# EAGLE design VIVA_PIC16_REV5-0 (EAGLE 9.6.2)

## Sheet 1 of 3
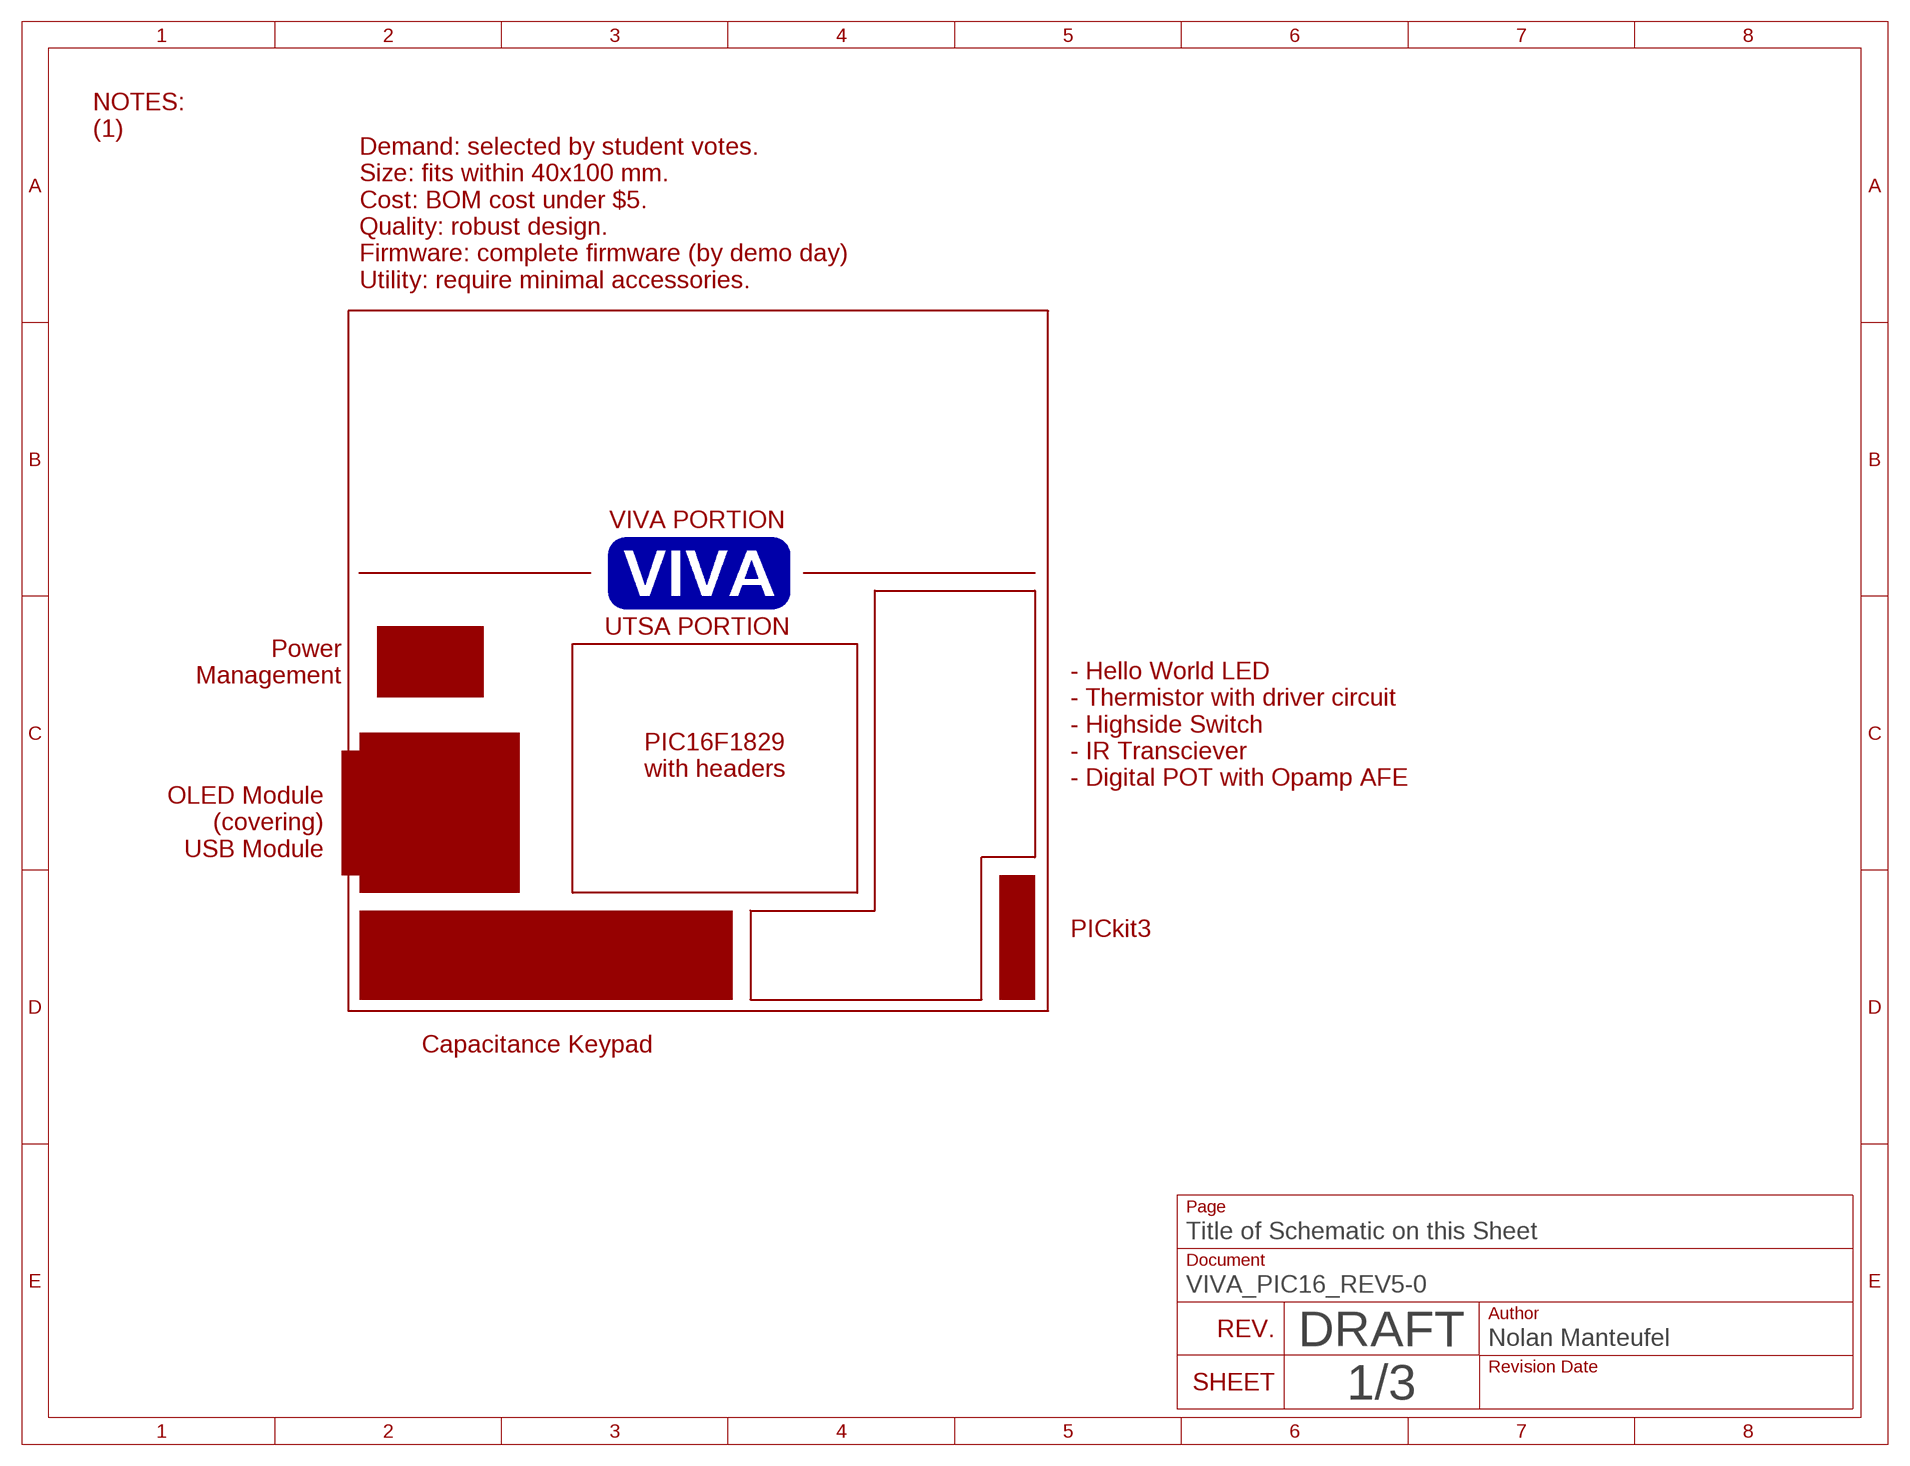
[diagram p0: schematic, sheet 1, part 1 of 2]
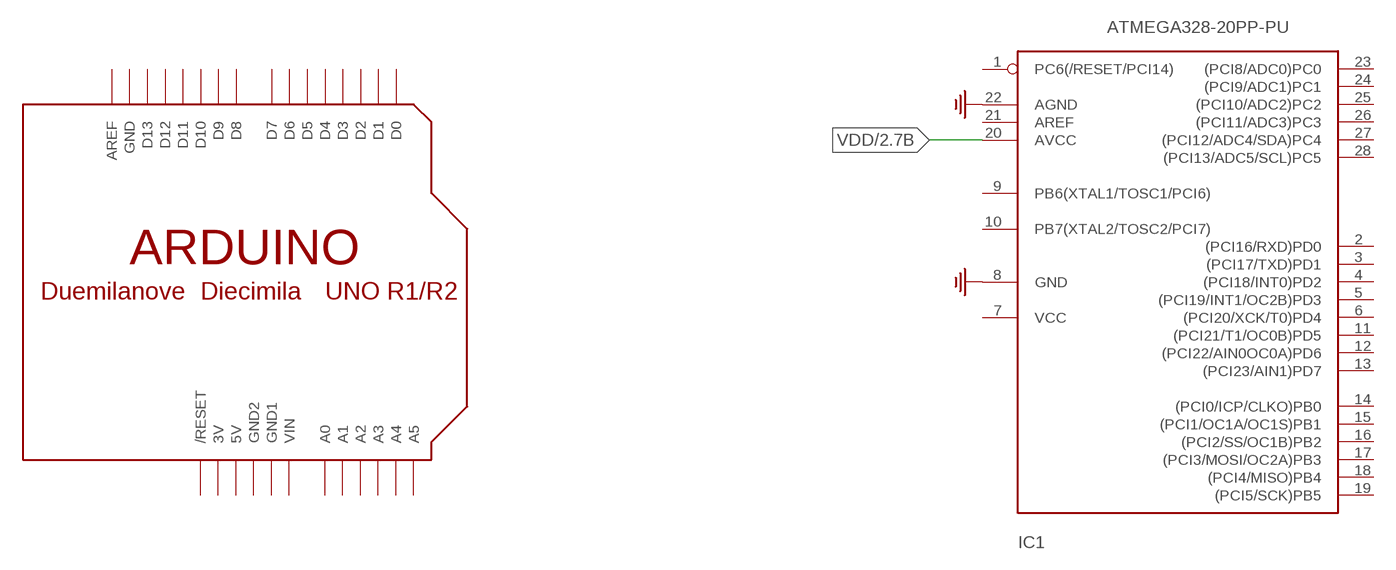
[diagram p1: schematic, sheet 1, part 2 of 2]

### Parts
IC1  ATMEGA328-20PP-PU  [DIL28-3]
U$1  VIVA_LOGO  [VIVA_LOGO]
U$3  ARDUINOUNO  [ARDUINO]

### Nets
GND: IC1.8(GND) IC1.22(AGND) ; also sheet 2,3
VDD: IC1.20(AVCC) ; also sheet 2,3
Unconnected: IC1.1(PC6(/RESET/PCI14)) IC1.2((PCI16/RXD)PD0) IC1.3((PCI17/TXD)PD1) IC1.4((PCI18/INT0)PD2) IC1.5((PCI19/INT1/OC2B)PD3) IC1.6((PCI20/XCK/T0)PD4) IC1.7(VCC) IC1.9(PB6(XTAL1/TOSC1/PCI6)) IC1.10(PB7(XTAL2/TOSC2/PCI7)) IC1.11((PCI21/T1/OC0B)PD5) IC1.12((PCI22/AIN0OC0A)PD6) IC1.13((PCI23/AIN1)PD7) IC1.14((PCI0/ICP/CLKO)PB0) IC1.15((PCI1/OC1A/OC1S)PB1) IC1.16((PCI2/SS/OC1B)PB2) IC1.17((PCI3/MOSI/OC2A)PB3) IC1.18((PCI4/MISO)PB4) IC1.19((PCI5/SCK)PB5) IC1.21(AREF) IC1.23((PCI8/ADC0)PC0) IC1.24((PCI9/ADC1)PC1) IC1.25((PCI10/ADC2)PC2) IC1.26((PCI11/ADC3)PC3) IC1.27((PCI12/ADC4/SDA)PC4) IC1.28((PCI13/ADC5/SCL)PC5) U$3.A0 U$3.A1 U$3.A2 U$3.A3 U$3.A4 U$3.A5 U$3.AREF U$3.D0 U$3.D1 U$3.D2 U$3.D3 U$3.D4 U$3.D5 U$3.D6 U$3.D7 U$3.D8 U$3.D9 U$3.D10 U$3.D11 U$3.D12 U$3.D13 U$3.RESET(/RESET)

### Notes on the sheet
- NOTES:
  (1)
- Demand: selected by student votes.
  Size: fits within 40x100 mm.
  Cost: BOM cost under $5.
  Quality: robust design.
  Firmware: complete firmware (by demo day)
  Utility: require minimal accessories.
- VIVA PORTION
- UTSA PORTION
- Power
  Management
- - Hello World LED
  - Thermistor with driver circuit
  - Highside Switch
  - IR Transciever
  - Digital POT with Opamp AFE
- PIC16F1829
  with headers
- OLED Module
  (covering)
  USB Module
- PICkit3
- Capacitance Keypad
- Page
- Title of Schematic on this Sheet
- Document
- REV. | Author
- DRAFT
- Nolan Manteufel
- SHEET | Revision Date

## Sheet 2 of 3
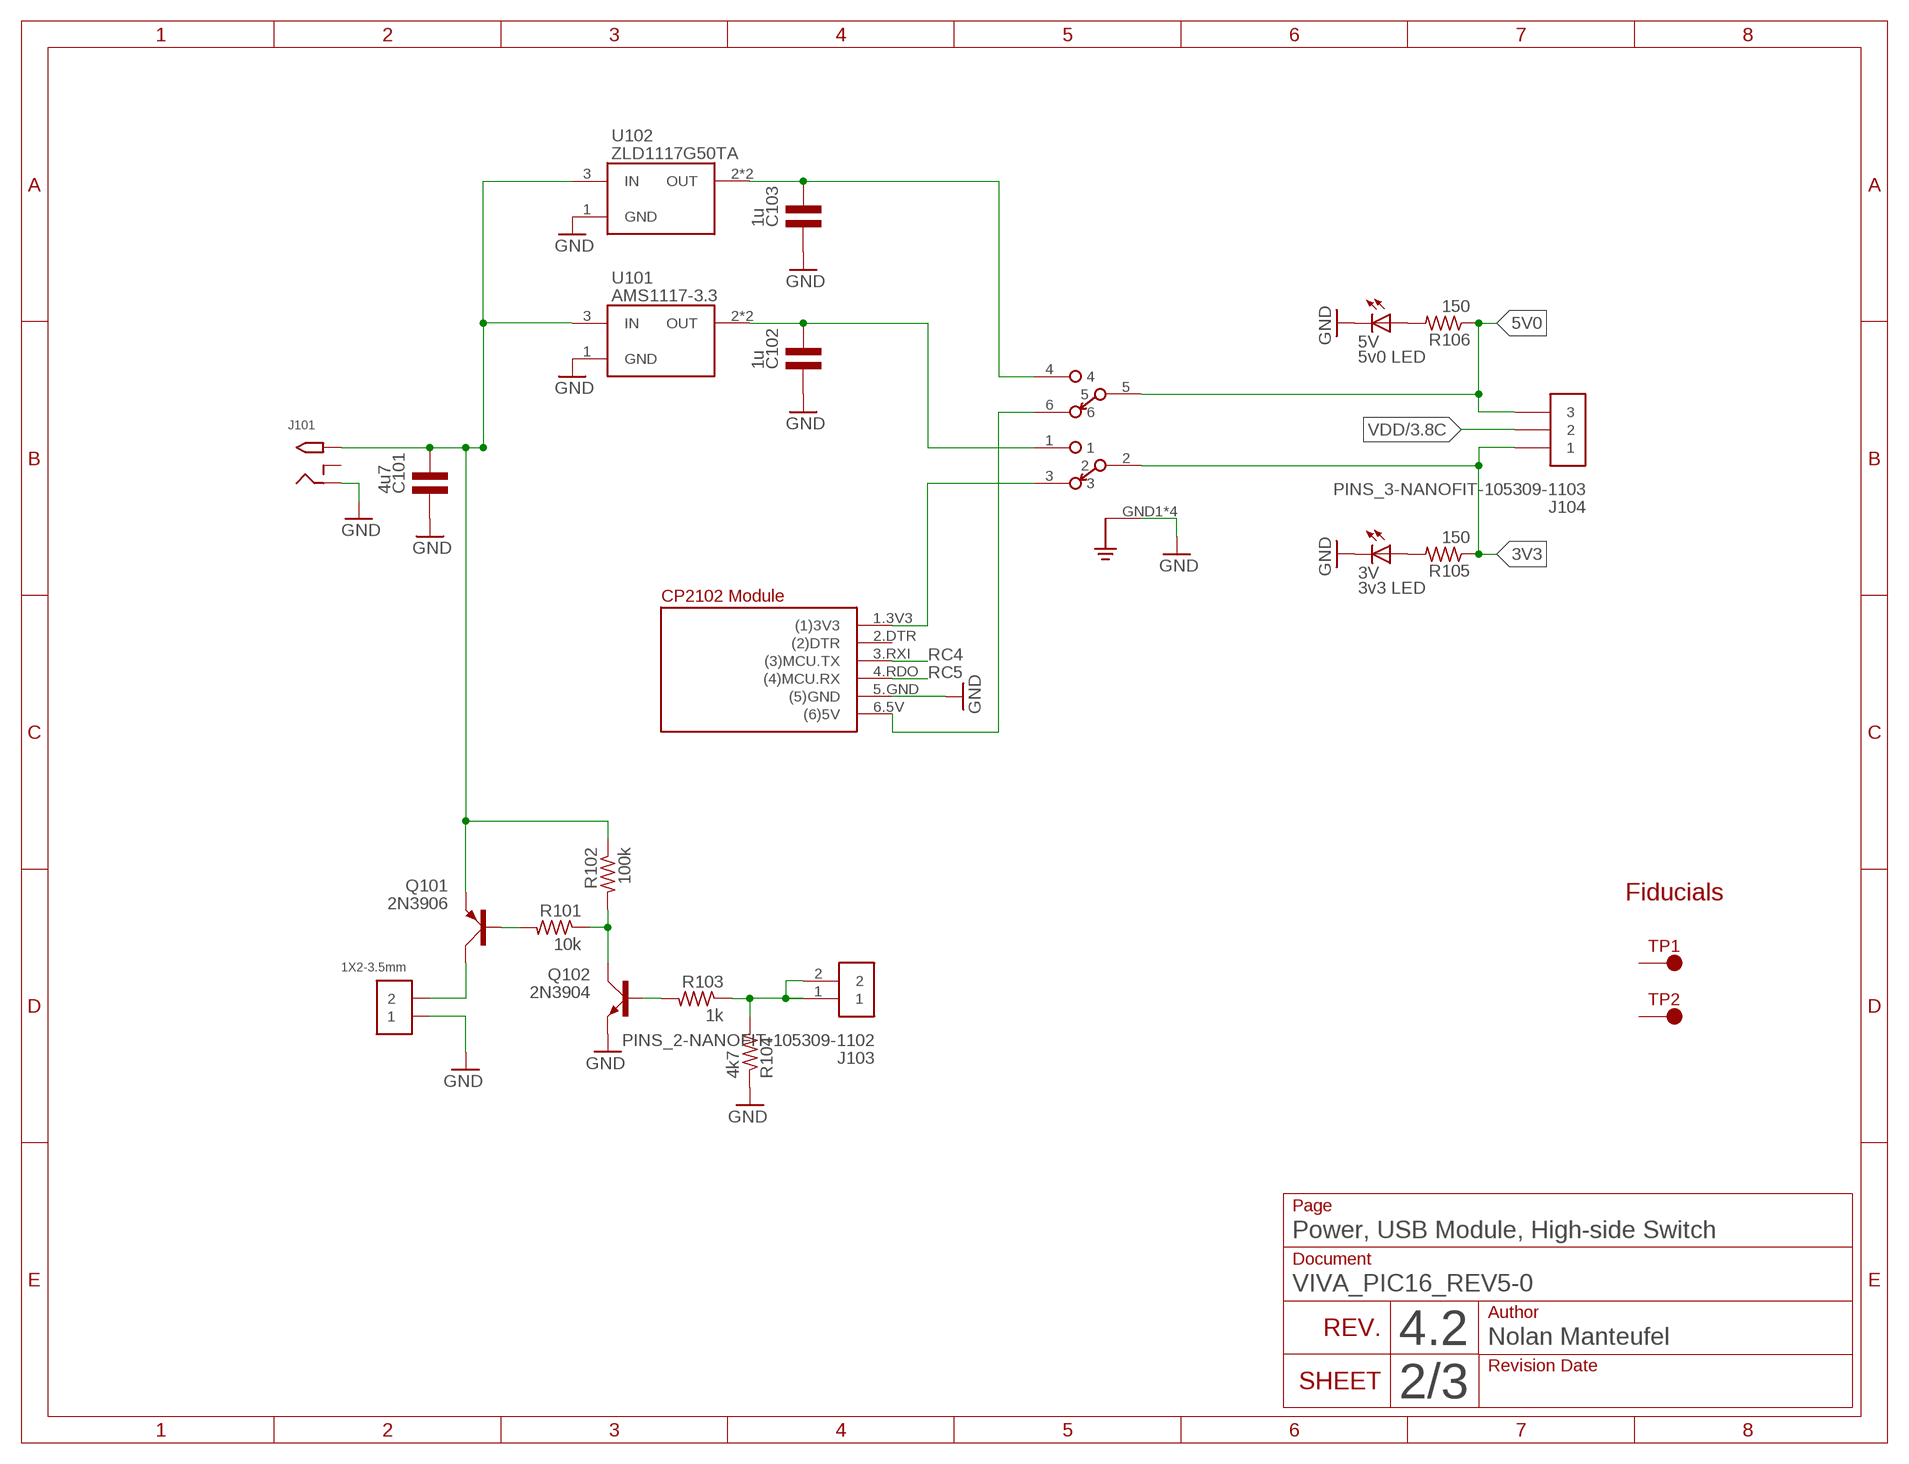
[diagram p2: schematic, sheet 2]

### Parts
3V  3v3 LED  LEDCHIPLED_0805  [CHIPLED_0805]
5V  5v0 LED  LEDCHIPLED_0805  [CHIPLED_0805]
C101  4u7  C0805  [C0805]
C102  1u  C0805  [C0805]
C103  1u  C0805  [C0805]
J101  2.1MMJACKTHM  [PJ-102A]
J102  1X2-3.5MM-3.5MM  [1X2-3.5MM]
J103  PINS_2-NANOFIT-105309-1102  [PINS_2-NANOFIT]
J104  PINS_3-NANOFIT-105309-1103  [PINS_3-NANOFIT]
M101  VIVA_USB-TTL  [VIVA_USB_TTL_SUBTEXT]
Q101  2N3906  2N3906SOT23  [SOT23]
Q102  2N3904  2N3904SOT23  [SOT23]
R101  10k  R-US_R0805  [R0805]
R102  100k  R-US_R0805  [R0805]
R103  1k  R-US_R0805  [R0805]
R104  4k7  R-US_R0805  [R0805]
R105  150  R-US_R0805  [R0805]
R106  150  R-US_R0805  [R0805]
S101  SWITCH_OS202013  [OS202013MT5QN1]
TP1  TESTPOINTFIDUCIAL  [FIDUCIAL]
TP2  TESTPOINTFIDUCIAL  [FIDUCIAL]
U101  AMS1117-3.3  REGULATOR_SCHLM1117  [SOT223]
U102  ZLD1117G50TA  REGULATOR_SCHLM1117  [SOT223]

### Nets
3V3: J104.1 R105.1 S101.2
5V0: J104.3 R106.1 S101.5
GND: 3V.C 5V.C C101.1 C102.1 C103.1 J101.RING J102.1 M101.5.GND((5)GND) Q102.2(E) R104.1 S101.GND1(GND) S101.GND2(GND) S101.GND3(GND) S101.GND4(GND) U101.1(GND) U102.1(GND) ; also sheet 1,3
N$1: J103.1 J103.2 R103.1 R104.2
N$2: 5V.A R106.2
N$5: Q101.1(B) R101.2
N$8: Q102.3(C) R101.1 R102.2
N$10: Q102.1(B) R103.2
N$14: M101.1.3V3((1)3V3) S101.3
N$15: J102.2 Q101.3(C)
N$16: M101.6.5V((6)5V) S101.6
N$17: C103.2 S101.4 U102.2(OUT) U102.4.TAB(OUT)
N$18: C102.2 S101.1 U101.2(OUT) U101.4.TAB(OUT)
N$21: 3V.A R105.2
RC4: M101.3.RXI((3)MCU.TX) ; also sheet 3
RC5: M101.4.RDO((4)MCU.RX) ; also sheet 3
VDC: C101.2 J101.TIP Q101.2(E) R102.1 U101.3(IN) U102.3(IN)
VDD: J104.2 ; also sheet 1,3
Unconnected: J101.RING_SW M101.2.DTR((2)DTR) TP1.FIDUCIAL TP2.FIDUCIAL

### Notes on the sheet
- Fiducials
- Page
- Power, USB Module, High-side Switch
- Document
- REV. | Author
- 4.2 | Nolan Manteufel
- SHEET | Revision Date

## Sheet 3 of 3
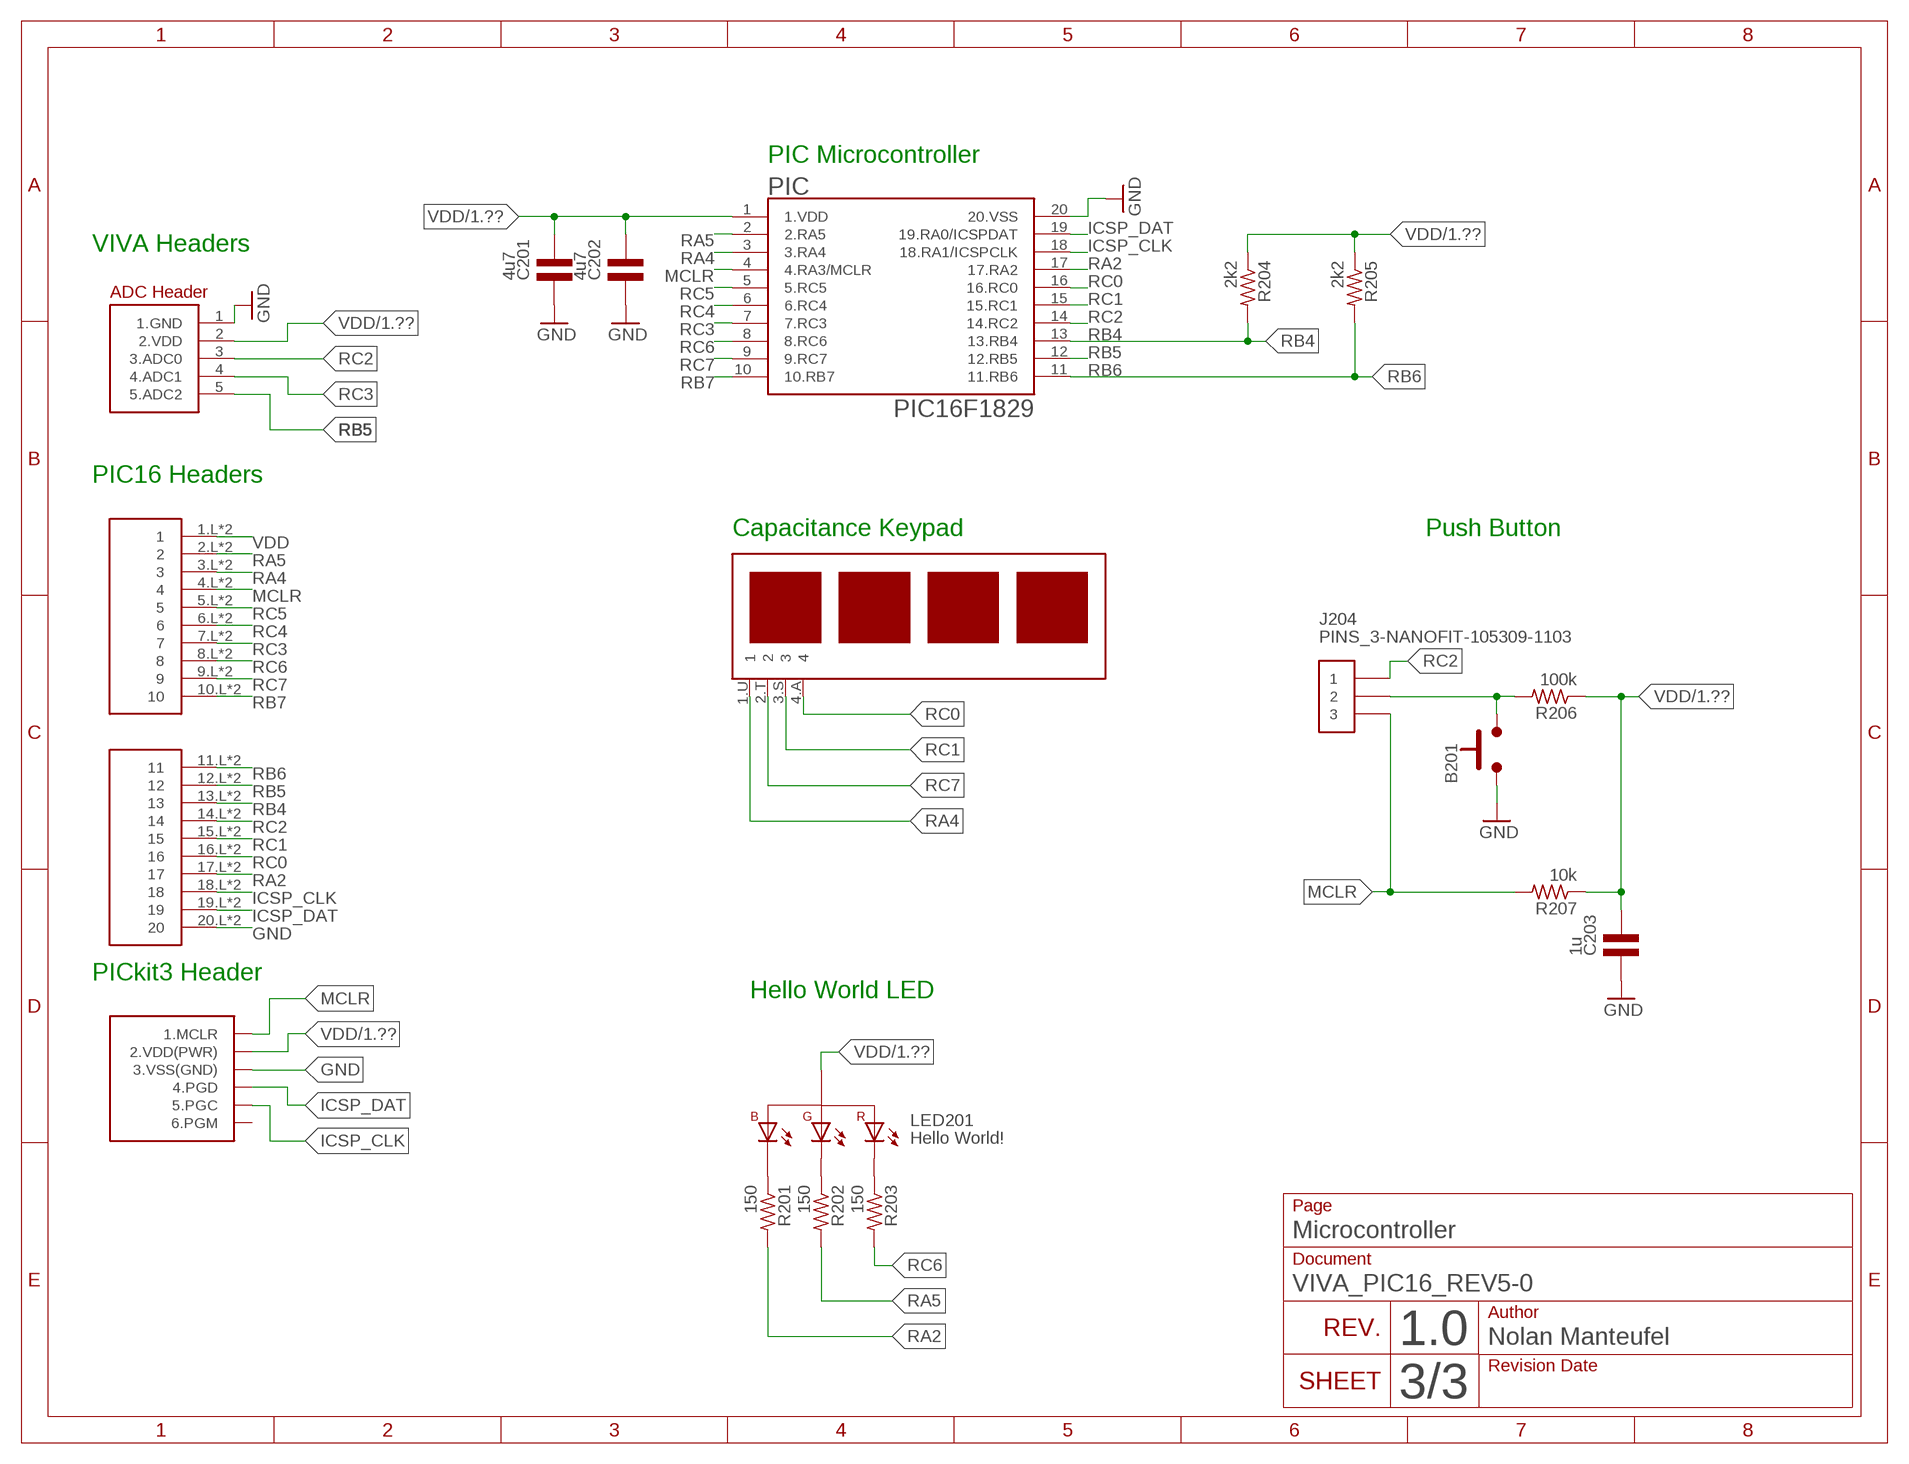
[diagram p3: schematic, sheet 3]

### Parts
B201  PUSHBUTTON6X6MM  [6X6MM]
C201  4u7  C0805  [C0805]
C202  4u7  C0805  [C0805]
C203  1u  C0805  [C0805]
J201  VIVA_PIC16  [VIVA_PIC16]
J202  VIVA-HEADER-ADCNONAME  [VIVA-HEADER-ADC-NONAME]
J203  PICKIT3  [PICKIT3]
J204  PINS_3-NANOFIT-105309-1103  [PINS_3-NANOFIT]
LED201  Hello World!  RGB_LEDLTST-C19FD1WT  [0805_RGB]
PIC  PIC16F1829  [SOP20-NEW]
R201  150  R-US_R0805  [R0805]
R202  150  R-US_R0805  [R0805]
R203  150  R-US_R0805  [R0805]
R204  2k2  R-US_R0805  [R0805]
R205  2k2  R-US_R0805  [R0805]
R206  100k  R-US_R0805  [R0805]
R207  10k  R-US_R0805  [R0805]
U$201  VIVA_UTSA-KEYPAD  [VIVA_UTSA-KEYPAD]

### Nets
GND: B201.1.A B201.2.A C201.1 C202.1 C203.1 J201.20.L J201.20.R J202.1(1.GND) J203.3(3.VSS(GND)) PIC.20(20.VSS) ; also sheet 1,2
ICSP_CLK: J201.18.L J201.18.R J203.5(5.PGC) PIC.18(18.RA1/ICSPCLK)
ICSP_DAT: J201.19.L J201.19.R J203.4(4.PGD) PIC.19(19.RA0/ICSPDAT)
MCLR: J201.4.L J201.4.R J203.1(1.MCLR) J204.3 PIC.4(4.RA3/MCLR) R207.2
N$7: B201.3.B B201.4.B J204.2 R206.2
N$11: LED201.1(4.B-) R201.1
N$12: LED201.3(2.G-) R202.1
N$13: LED201.2(1.R-) R203.1
RA2: J201.17.L J201.17.R PIC.17(17.RA2) R201.2
RA4: J201.3.L J201.3.R PIC.3(3.RA4) U$201.1.U
RA5: J201.2.L J201.2.R PIC.2(2.RA5) R202.2
RB4: J201.13.L J201.13.R PIC.13(13.RB4) R204.2
RB5: J201.12.L J201.12.R J202.5(5.ADC2) PIC.12(12.RB5)
RB6: J201.11.L J201.11.R PIC.11(11.RB6) R205.2
RB7: J201.10.L J201.10.R PIC.10(10.RB7)
RC0: J201.16.L J201.16.R PIC.16(16.RC0) U$201.4.A
RC1: J201.15.L J201.15.R PIC.15(15.RC1) U$201.3.S
RC2: J201.14.L J201.14.R J202.3(3.ADC0) J204.1 PIC.14(14.RC2)
RC3: J201.7.L J201.7.R J202.4(4.ADC1) PIC.7(7.RC3)
RC4: J201.6.L J201.6.R PIC.6(6.RC4) ; also sheet 2
RC5: J201.5.L J201.5.R PIC.5(5.RC5) ; also sheet 2
RC6: J201.8.L J201.8.R PIC.8(8.RC6) R203.2
RC7: J201.9.L J201.9.R PIC.9(9.RC7) U$201.2.T
VDD: C201.2 C202.2 C203.2 J201.1.L J201.1.R J202.2(2.VDD) J203.2(2.VDD(PWR)) LED201.4(3.+) PIC.1(1.VDD) R204.1 R205.1 R206.1 R207.1 ; also sheet 1,2
Unconnected: J203.6(6.PGM)

### Notes on the sheet
- PIC Microcontroller
- VIVA Headers
- PIC16 Headers
- Capacitance Keypad | Push Button
- PICkit3 Header
- Hello World LED
- Page
- Microcontroller
- Document
- REV. | Author
- 1.0 | Nolan Manteufel
- SHEET | Revision Date

## Power pins joined to a net without a drawn wire
3V: U$3.3V
5V: U$3.5V
GND: U$3.GND
GND1: U$3.GND1
GND2: U$3.GND2
VIN: U$3.VIN

## Library data of the parts
3V 5V = adafruit:LED: LED OSRAM: - CHIPLED LG R971, LG N971, LY N971, LG Q971, LY Q971, LO R971, LY R971 LH N974, LH R974 LS Q976, LO Q976, LY Q976 LO Q996 - Hyper CHIPLED LW Q18S LB Q993, LB Q99A, LB R99A - SideLED LS A670, LO A670, LY A670, LG A670, LP A670 LB A673, LV A673, LT A673, LW A673 LH A674 LY A675 LS A676, LA A676, LO A676, LY A676, LW A676 LS A679, LY A679, LG A679 - Hyper Micro SIDELED® LS Y876, LA Y876, LO Y876, LY Y876 LT Y87S - SmartLED LW L88C, LW L88S LB L89C, LB L89S, LG L890 LS L89K, LO L89K, LY L89K LS L896, LA L896, LO L896, LY L896 - TOPLED LS T670, LO T670, LY T670, LG T670, LP T670 LSG T670, LSP T670, LSY T670, LOP T670, LYG T670 LG T671, LOG T671, LSG T671 LB T673, LV T673, LT T673, LW T673 LH T674 LS T676, LA T676, LO T676, LY T676, LB T676, LH T676, LSB T676, LW T676 LB T67C, LV T67C, LT T67C, LS T67K, LO T67K, LY T67K, LW E67C LS E67B, LA E67B, LO E67B, LY E67B, LB E67C, LV E67C, LT E67C LW T67C LS T679, LY T679, LG T679 LS T770, LO T770, LY T770, LG T770, LP T770 LB T773, LV T773, LT T773, LW T773 LH T774 LS E675, LA E675, LY E675, LS T675 LS T776, LA T776, LO T776, LY T776, LB T776 LHGB T686 LT T68C, LB T68C - Hyper Mini TOPLED® LB M676 - Mini TOPLED Santana® LG M470 LS M47K, LO M47K, LY M47K Source: http://www.osram.convergy.de/
B201 = nolan-utsa:PUSHBUTTON: Tactile push button switch
C101-C103 C201-C203 = nolan-utsa:C
IC1 = nolan-utsa:ATMEGA328*P: MICROCONTROLLER 32 kBytes FLASH 2 kBytes SRAM 1 kBytes EEPROM USART 8-channel 10 bit ADC
J101 = nolan-utsa:2.1MMJACK: 2.1mm x 5.5mm THM DC jack with internal switch. Digikey part #PJ-102A, 4UCON part #05537 2.1mm x 5.5mm SMT DC jack with internal switch. Digikey part #PJ-002A-SMT, 4UCON part #03267 By microbuilder.eu & adafruit.com
J102 = nolan-utsa:1X2-3.5MM: 3.5mm Terminal block http://www.ladyada.net/library/pcb/eaglelibrary.html
J103 = nolan-utsa:PINS_2
J104 J204 = nolan-utsa:PINS_3
J201 = nolan-viva:VIVA_PIC16
J202 = nolan-utsa:VIVA-HEADER-ADC
J203 = nolan-viva:PICKIT3
LED201 = nolan-utsa:RGB_LED
M101 = nolan-utsa:VIVA_USB-TTL
PIC = nolan-utsa:PIC16F1829
Q101 = nolan-utsa:2N3906: PNP TRANSISTOR
Q102 = nolan-utsa:2N3904: NPN TRANSISTOR
R101-R106 R201-R207 = adafruit:R-US_: RESISTOR, American symbol
S101 = nolan-utsa:SWITCH_OS202013
TP1 TP2 = nolan-utsa:TESTPOINT
U101 U102 = nolan-utsa:REGULATOR_SCH: Linear Regulator in SOT-223 package. NOTE: select correct pinout for your application. Tab may be OUT or GND!
U$1 = nolan-utsa:VIVA_LOGO
U$3 = nolan-utsa:ARDUINO: Arduino Diecimila/Duemilanove Make a shield with ease, this package has all the named pins as well as the two mounting drill holes and an outline of the USB and DC power connector. The outline is on the DIMENSION layer, so if your board house uses it they will cut the outline to match. http://www.ladyada.net/library/pcb/eaglelibrary.html
U$201 = nolan-utsa:VIVA_UTSA-KEYPAD

## Board
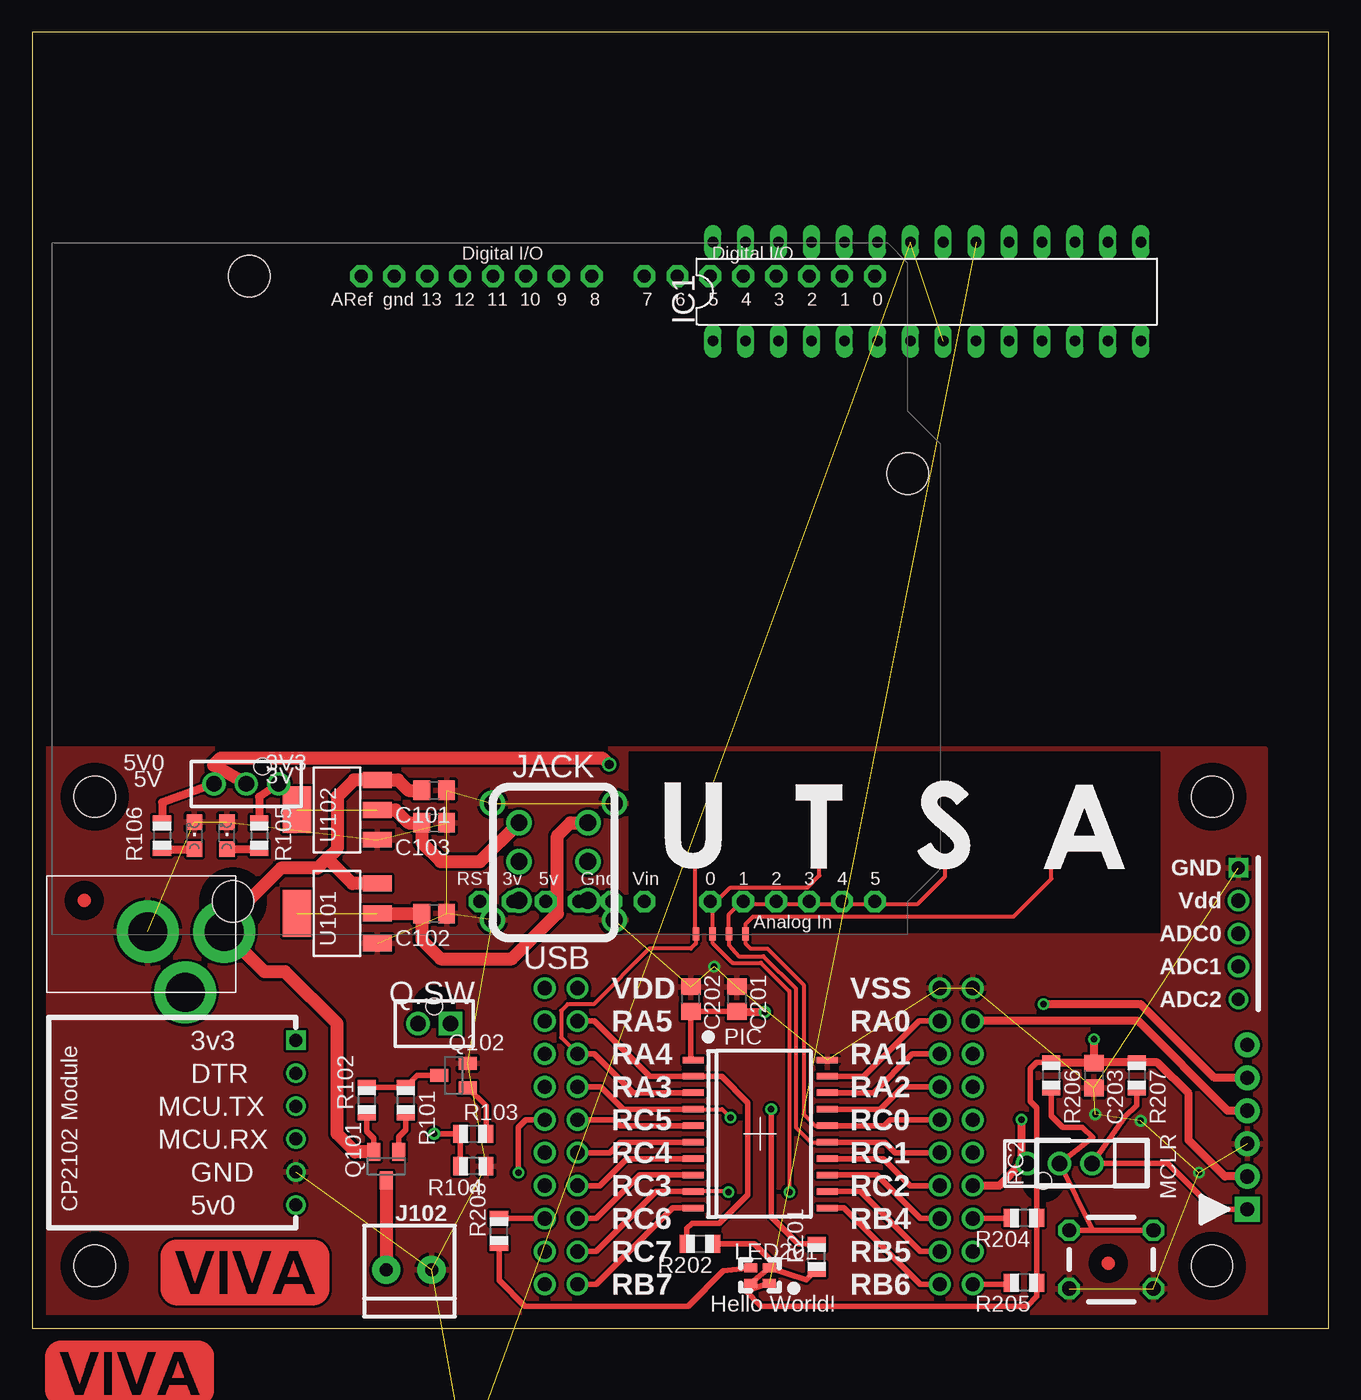
[diagram p4: board, top side]
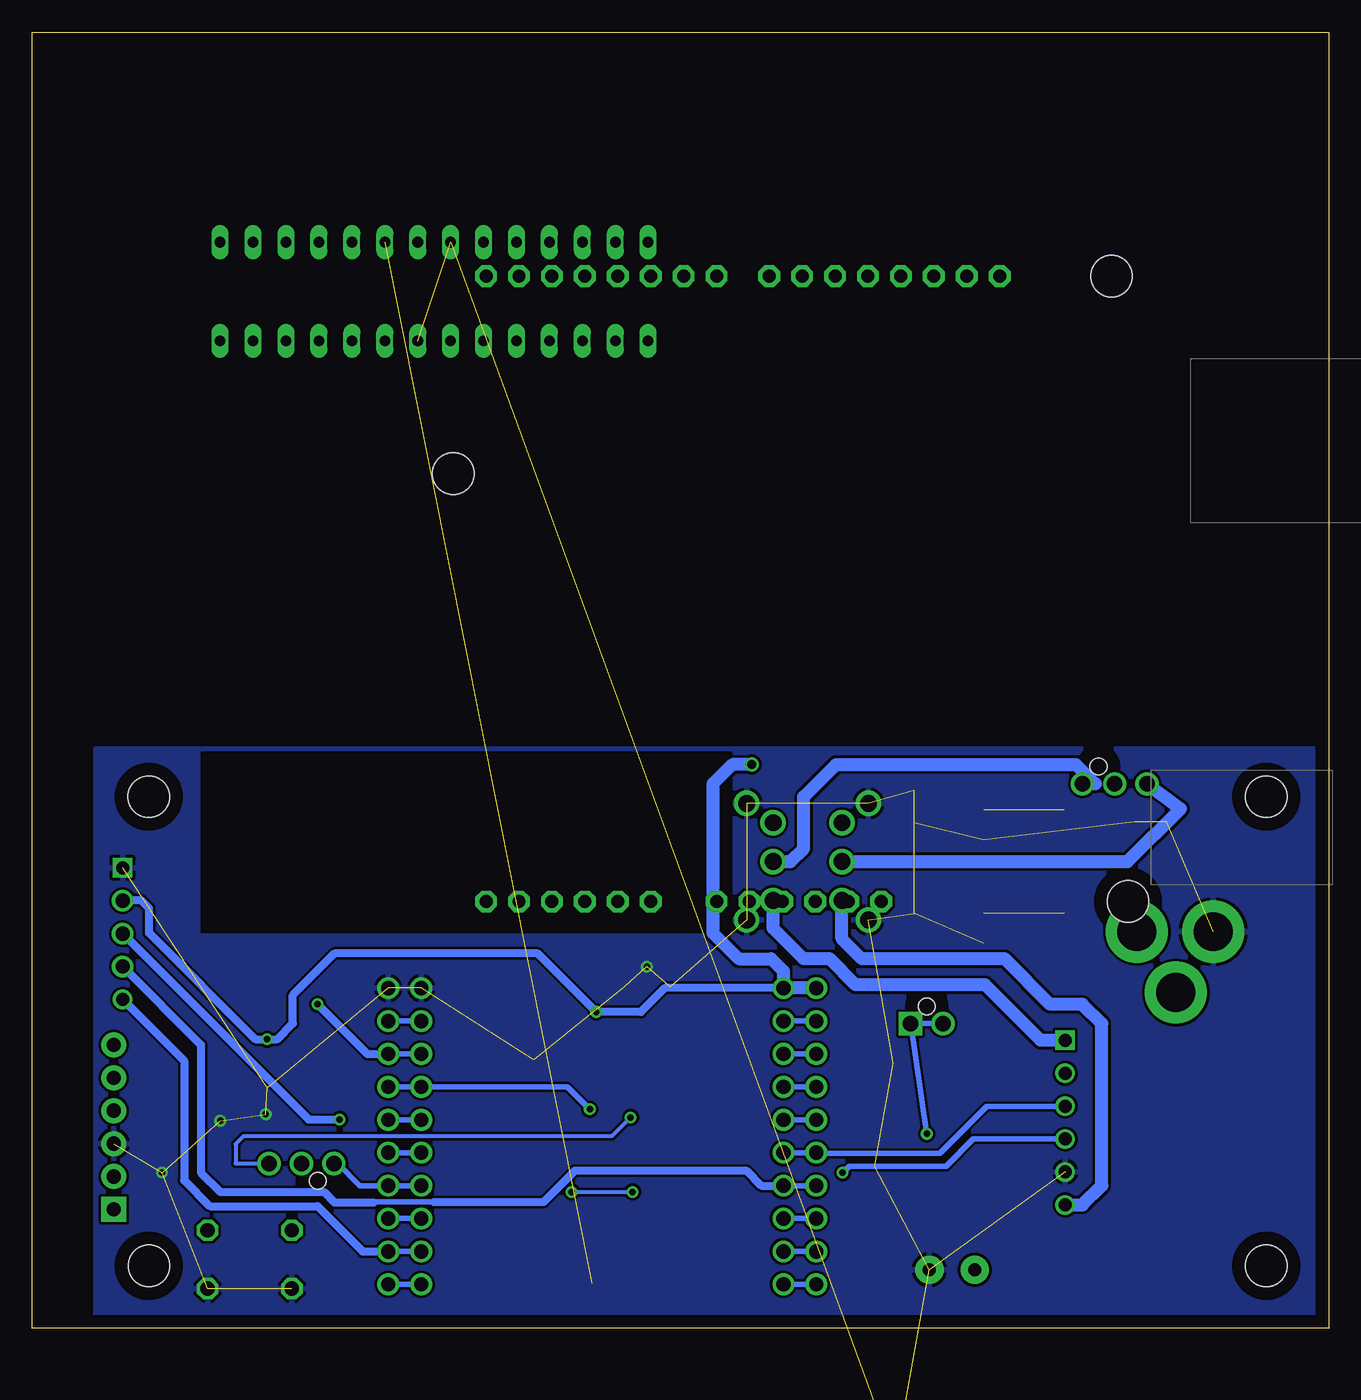
[diagram p5: board, bottom side, seen from below]

Size 100 x 100 mm. Coordinates in mm from the lower left corner, seen from the top.
Outline: 0,0 100,0 100,100 0,100 0,0
Copper layers (1*16): Top 0.035mm / dielectric 1.5mm / Bottom 0.035mm
Design rules "default *": minimum track width 10mil, minimum drill 24mil, track to track 8mil, track to pad 8mil, pad to pad 8mil, via to via 8mil, smd to smd 8mil, copper to edge 40mil, drill to drill 8mil, minimum pad ring 10mil, minimum via ring 8mil, stop-mask expansion 4mil, vias tented up to drill 20mil, thermal gap 10mil
Holes 3.2 mm at 4.82,41.01 4.82,4.81 91.01,4.81 91.02,41.01

### Footprints (pad centres in the part's own frame; a part is rotated, then mirrored left to right if it is on the bottom)
CHIPLED_0805 = smd 1.2 x 1.2: A 0,-1.05; C 0,1.05
6X6MM = drill 1.1 octagon: 1.A 0,0; 2.A 6.5,0; 3.B 0,4.5; 4.B 6.5,4.5
C0805 = smd 1.3 x 1.5: 1 -0.95,0; 2 0.95,0
DIL28-3 = drill 0.813 long: 1 -16.51,-3.81; 2 -13.97,-3.81; 3 -11.43,-3.81; 4 -8.89,-3.81; 5 -6.35,-3.81; 6 -3.81,-3.81; 7 -1.27,-3.81; 8 1.27,-3.81; 9 3.81,-3.81; 10 6.35,-3.81; 11 8.89,-3.81; 12 11.43,-3.81; 13 13.97,-3.81; 14 16.51,-3.81; 15 16.51,3.81; 16 13.97,3.81; 17 11.43,3.81; 18 8.89,3.81; 19 6.35,3.81; 20 3.81,3.81; 21 1.27,3.81; 22 -1.27,3.81; 23 -3.81,3.81; 24 -6.35,3.81; 25 -8.89,3.81; 26 -11.43,3.81; 27 -13.97,3.81; 28 -16.51,3.81
PJ-102A = drill 3 pad 4.8: RING 0.1,-3.39; RING_SW -4.6,-6.29; TIP 0.1,-9.29
1X2-3.5MM = drill 1 pad 2.184: 1 1.8,0; 2 -1.7,0
PINS_2-NANOFIT = drill 1.2 square: 1 -1.25,0 | drill 1.2: 2 1.25,0 | hole 1.3: 0,-1.34
PINS_3-NANOFIT = drill 1.2: 1 -2.5,0; 2 0,0; 3 2.5,0 | hole 1.3: -1.25,-1.34
VIVA_PIC16 = drill 1.1 pad 1.676: 1.L -2.54,0; 1.R 0,0; 2.L -2.54,-2.54; 2.R 0,-2.54; 3.L -2.54,-5.08; 3.R 0,-5.08; 4.L -2.54,-7.62; 4.R 0,-7.62; 5.L -2.54,-10.16; 5.R 0,-10.16; 6.L -2.54,-12.7; 6.R 0,-12.7; 7.L -2.54,-15.24; 7.R 0,-15.24; 8.L -2.54,-17.78; 8.R 0,-17.78; 9.L -2.54,-20.32; 9.R 0,-20.32; 10.L -2.54,-22.86; 10.R 0,-22.86; 11.L 27.94,-22.86; 11.R 30.48,-22.86; 12.L 27.94,-20.32; 12.R 30.48,-20.32; 13.L 27.94,-17.78; 13.R 30.48,-17.78; 14.L 27.94,-15.24; 14.R 30.48,-15.24; 15.L 27.94,-12.7; 15.R 30.48,-12.7; 16.L 27.94,-10.16; 16.R 30.48,-10.16; 17.L 27.94,-7.62; 17.R 30.48,-7.62; 18.L 27.94,-5.08; 18.R 30.48,-5.08; 19.L 27.94,-2.54; 19.R 30.48,-2.54; 20.L 27.94,0; 20.R 30.48,0
VIVA-HEADER-ADC-NONAME = drill 1 square: 1 0,0 | drill 1.1: 2 2.54,0; 3 5.08,0; 4 7.62,0 | drill 1: 5 10.16,0
PICKIT3 = drill 1.1 pad 1.93 square: 1 0,0 | drill 1.1 pad 1.93: 2 2.54,0; 3 5.08,0; 4 7.62,0; 5 10.16,0; 6 12.7,0
0805_RGB = smd 1 x 0.7: 1 0.7,0.6; 2 -0.7,0.6; 3 -0.7,-0.6; 4 0.7,-0.6
VIVA_USB_TTL_SUBTEXT = drill 1 square: 1.3V3 0,0 | drill 1: 2.DTR 0,-2.54; 3.RXI 0,-5.08; 4.RDO 0,-7.62; 5.GND 0,-10.16; 6.5V 0,-12.7
SOP20-NEW = smd 0.5 x 1.6: 1 -5.715,-5.152; 2 -4.445,-5.152; 3 -3.175,-5.152; 4 -1.905,-5.152; 5 -0.635,-5.152; 6 0.635,-5.152; 7 1.905,-5.152; 8 3.175,-5.152; 9 4.445,-5.152; 10 5.715,-5.152; 11 5.715,5.188; 12 4.445,5.188; 13 3.175,5.188; 14 1.905,5.188; 15 0.635,5.188; 16 -0.635,5.188; 17 -1.905,5.188; 18 -3.175,5.188; 19 -4.445,5.188; 20 -5.715,5.188
SOT23 = smd 1 x 1.4: 1 -0.95,-1.1; 2 0.95,-1.1; 3 0,1.1
R0805 = smd 1.1 x 1.4: 1 -1,0; 2 1,0
OS202013MT5QN1 = drill 1.3: 1 1.499,7.353; 2 4.496,7.353; 3 7.493,7.353; 4 1.499,2.045; 5 4.496,2.045; 6 7.493,2.045; GND1 0,9.398; GND2 8.992,9.398; GND3 0,0; GND4 8.992,0
FIDUCIAL = smd 0 x 0: FIDUCIAL 0,0
SOT223 = smd 1.219 x 2.235: 1 -2.311,-3.099; 2 0,-3.099; 3 2.311,-3.099 | smd 3.6 x 2.2: 4.TAB 0,3.099
ARDUINO = drill 1 pad 1.676 octagon: 3V 35.56,2.54; 5V 38.1,2.54; A0 50.8,2.54; A1 53.34,2.54; A2 55.88,2.54; A3 58.42,2.54; A4 60.96,2.54; A5 63.5,2.54; AREF 23.876,50.8; D0 63.5,50.8; D1 60.96,50.8; D2 58.42,50.8; D3 55.88,50.8; D4 53.34,50.8; D5 50.8,50.8; D6 48.26,50.8; D7 45.72,50.8; D8 41.656,50.8; D9 39.116,50.8; D10 36.576,50.8; D11 34.036,50.8; D12 31.496,50.8; D13 28.956,50.8; GND 26.416,50.8; GND1 43.18,2.54; GND2 40.64,2.54; RESET 33.02,2.54; VIN 45.72,2.54 | hole 3.2: 15.24,50.8; 66.04,35.56; 13.97,2.54
VIVA_UTSA-KEYPAD = smd 0.5 x 1: 1.U -3.81,-5.08; 2.T -2.54,-5.08; 3.S -1.27,-5.08; 4.A 0,-5.08

### Placement (x,y rotation side)
3V  15,38 0 top
5V  12.5,38 0 top
B201  79.99,3.05 0 top
C101  31,41.5 180 top
C102  31,32 180 top
C103  31,39 180 top
C201  54.36,25.4 270 top
C202  50.8,25.4 270 top
C203  81.9,19.5 90 top
IC1  69,80 0 top
J101  5.5,30.5 90 top
J102  29,4.5 0 top
J103  31,23.5 180 top
J104  16.5,42 180 top
J201  42.06,26.24 0 top
J202  93.04,35.53 270 top
J203  93.73,9.16 90 top
J204  79.25,12.7 0 top
LED201  56.13,4.06 0 top
M101  20.32,22.21 0 top
PIC  56.13,14.99 270 top
Q101  27.3,12.5 180 top
Q102  32.5,19.5 90 top
R101  28.8,17.6 270 top
R102  25.8,17.6 90 top
R103  34,15 0 top
R104  34,12.5 180 top
R105  17.5,38 270 top
R106  10,38 270 top
R201  60.5,5.5 90 top
R202  51.5,6.5 180 top
R203  36,7.5 90 top
R204  76.5,8.5 180 top
R205  76.5,3.5 180 top
R206  78.6,19.5 270 top
R207  85.2,19.5 270 top
S101  35.5,40.5 270 top
TP1  83,5 0 top
TP2  4,33 0 top
U101  23.5,32 90 top
U102  23.5,40 90 top
U$1  1,-6 0 top  (outside the outline)
U$2  [VIVA_LOGO]  9.91,1.79 0 top
U$3  1.5,30.38 0 top
U$201  55,35.5 0 top

### Tracks (layer width: path | path; a pad name or v marks a point on that pad's centre or on a via)
3V3
  Top 0.61: J104.1 17.5,41 R105.1
  Bottom 1.016: S101.2 41.5,36 40.5,37 40.5,41 38,43.5 19.5,43.5 18,42 J104.1
5V0
  Top 0.61: J104.3 10,40.58 R106.1
  Bottom 1.016: S101.5 15.5,36 11.42,40.08 J104.3
GND  (via drill 0.5)  (32 unrouted)
  other vias: 52.6,27.9 82,16.5 85.5,16 90,12
  pour Top: 0.81,0.81 0.81,44.7 95.1,44.7 95.1,0.81
  pour Bottom: 0.81,0.81 0.81,44.7 95.1,44.7 95.1,0.81
ICSP_CLK  (via drill 0.5)
  Top 0.406: PIC.18 64.9,18.16 67.89,21.16 J201.18.L
  Top 0.61: J203.5 91.18,19.32 85.5,25 v78,25
  Bottom 0.406: J201.18.L J201.18.R
  Bottom 0.61: v78,25 74.16,21.16 J201.18.R
ICSP_DAT
  Top 0.406: PIC.19 64.14,19.43 68.4,23.7 J201.19.L
  Top 0.61: J203.4 92.22,16.78 85.3,23.7 J201.19.R
  Bottom 0.406: J201.19.L J201.19.R
MCLR  (via drill 0.5)
  Top 0.305: PIC.4 53.21,16.89 v53.85,16.26
  Top 0.406: 84.32,12.71 J204.3 | J201.4.R 43.87,18.62 45.59,16.89 PIC.4 | J204.3 87.61,12.7 91.15,9.16 J203.1 | R207.2 85.2,17.2 84.33,16.33 J204.3
  Bottom 0.305: v53.85,16.26 55.3,14.81 83.72,14.81 84.32,14.22 84.32,12.71 J204.3
  Bottom 0.406: J201.4.L J201.4.R
N$1  (via drill 0.5)
  Top 0.406: R104.2 R103.1 v31,15
  Bottom 0.406: v31,15 J103.1 J103.2
N$2
  Top 0.61: R106.2 10.05,36.95 5V.A
N$5
  Top 0.406: R101.2 28.8,15.3 28.25,14.75 Q101.1
N$7
  Top 0.406: B201.3.B 81.79,7.55 | 81.79,7.55 J204.2 81.79,14.71 81,15.5 79.5,15.5 78.6,16.4 R206.2 | 81.79,7.55 B201.4.B
N$8
  Top 0.406: R102.2 R101.1 29.7,19.5 Q102.3
N$10
  Top 0.406: Q102.1 35,17.15 R103.2
N$11
  Top 0.406: LED201.1 59.71,3.71 R201.1
N$12
  Top 0.406: LED201.3 57.23,4.97 55.7,6.5 R202.1
N$13
  Top 0.406: R203.1 36,3.7 38,1.7 50.6,1.7 53.31,4.41 LED201.2
N$14
  Bottom 1.016: M101.1.3V3 22.21,22.21 26.5,26.5 36.5,26.5 38.5,28.5 40.5,28.5 42.85,30.85 S101.3
N$15
  Top 1.016: Q101.3 J102.2
N$16
  Bottom 1.016: M101.6.5V 18.99,9.51 17.5,11 17.5,23.5 19,25 21.5,25 25,28.5 36,28.5 37.55,30.05 S101.6
N$17  (1 unrouted)
  Top 1.016: U102.2 28,40 29,39 C103.2 30.05,37.45 31.5,36 34.54,36 S101.4
N$18  (1 unrouted)
  Top 1.016: U101.2 C102.2 30.05,29.95 31.5,28.5 37,28.5 40.5,32 40.5,38 41.5,39 S101.1
N$21
  Top 0.61: 3V.A 15.05,37 R105.2
RA2  (via drill 0.5)
  Top 0.406: PIC.17 65.41,16.89 67.13,18.62 J201.17.L | R201.2 59.1,6.5 57,8.6 v57,16.9
  Bottom 0.406: J201.17.R J201.17.L 58.72,18.62 v57,16.9
RA4
  Top 0.305: U$201.1.U 51.19,29.69 50.8,29.3 47.6,29.3 43.3,25 41.3,25 40.8,24.5 40.8,22.42 J201.3.R
  Top 0.406: PIC.3 46.35,18.16 43.36,21.16 J201.3.R
  Bottom 0.406: J201.3.L J201.3.R
RA5
  Top 0.406: J201.2.R 43.36,23.7 47.62,19.43 PIC.2 53.17,19.43 55.2,17.4 55.2,10.3 53,8.1 50.9,8.1 50.5,7.7 R202.2
  Bottom 0.406: J201.2.R J201.2.L
RB4
  Top 0.406: PIC.13 65.15,11.81 68.5,8.46 J201.13.L | J201.13.R 75.46,8.46 R204.2
  Bottom 0.406: J201.13.L J201.13.R
RB5
  Top 0.406: PIC.12 63.88,10.54 68.5,5.92 J201.12.L
  Bottom 0.406: J201.12.L J201.12.R
  Bottom 0.61: J202.5 88.3,20.63 88.3,11.4 86.3,9.4 78,9.4 74.52,5.92 J201.12.R
RB6
  Top 0.406: PIC.11 62.61,9.27 68.5,3.38 J201.11.L | J201.11.R 75.38,3.38 R205.2
  Bottom 0.406: J201.11.L J201.11.R
RB7
  Top 0.406: PIC.10 49.4,9.27 43.51,3.38 J201.10.R
  Bottom 0.406: J201.10.L J201.10.R
RC0
  Top 0.305: U$201.4.A 55,29.7 55.4,29.3 56.7,29.3 59.5,26.5 59.5,16.5 60.38,15.62 PIC.16
  Top 0.406: PIC.16 65.72,15.62 66.18,16.08 J201.16.L
  Bottom 0.406: J201.16.L J201.16.R
RC1
  Top 0.305: U$201.3.S 53.73,29.57 54.5,28.7 56.4,28.7 58.9,26.2 58.9,15.5 60.05,14.35 PIC.15
  Top 0.406: PIC.15 65.75,14.35 66.56,13.54 J201.15.L
  Bottom 0.406: J201.15.L J201.15.R
RC2  (via drill 0.5)
  Top 0.406: J201.14.L 67.74,11 65.66,13.08 PIC.14
  Top 0.61: v76.3,16.1 76.3,12.7 74.6,11 J201.14.R
  Bottom 0.406: J201.14.L J201.14.R 74.75,11 76.45,12.7 J204.1
  Bottom 0.61: J202.3 78.69,16.1 v76.3,16.1
RC3
  Top 0.406: PIC.7 45.85,13.08 43.76,11 J201.7.R
  Bottom 0.406: J201.7.L J201.7.R | 73.7,9.7 73.67,9.73 69.01,9.73
  Bottom 0.61: J202.4 87,21.87 87,12 85.5,10.5 77.5,10.5 76.7,9.7 73.7,9.7 | 69.01,9.73 60.56,9.73 58.12,12.17 44.94,12.17 43.76,11 J201.7.R
RC4
  Top 0.406: PIC.6 45.34,14.35 44.53,13.54 J201.6.R
  Bottom 0.406: J201.6.R J201.6.L 39.48,13.5 30,13.5 26.37,17.13 M101.3.RXI
RC5  (via drill 0.5)
  Top 0.406: PIC.5 45.34,15.62 44.88,16.08 J201.5.R | v37.5,12 37.5,15.5 38.08,16.08 J201.5.L
  Bottom 0.406: J201.5.L J201.5.R | M101.4.RDO 27.41,14.59 29.5,12.5 37,12.5 v37.5,12
RC6
  Top 0.406: J201.8.R 43.51,8.46 46.86,11.81 PIC.8 | J201.8.L 36.04,8.46 R203.2
  Bottom 0.406: J201.8.L J201.8.R
RC7  (via drill 0.5)
  Top 0.305: U$201.2.T 52.46,29.74 54,28.2 56.2,28.2 58.4,26 v58.4,10.5 | v53.7,10.5 53.66,10.54 PIC.9
  Top 0.406: PIC.9 48.13,10.54 43.51,5.92 J201.9.R
  Bottom 0.305: v58.4,10.5 v53.7,10.5
  Bottom 0.406: J201.9.L J201.9.R
VDC
  Top 0.406: R102.1 25.8,15.2 26.35,14.65 Q101.2
  Top 1.016: 22.75,36.25 23.5,37 23.5,41 24.81,42.31 U102.3 28.19,42.31 29,41.5 C101.2 | 22.75,36.25 22,35.5 19.19,35.5 14.79,31.1 J101.TIP 17.89,27.5 19.5,27.5 23.5,23.5 23.5,15 24.9,13.6 Q101.2 | U101.3 24.69,34.31 22.75,36.25
VDD  (via drill 0.5, 0.7)  (1 unrouted)
  Top 0.406: PIC.1 50.8,20.88 C202.2 C201.2 | R206.1 77.5,20.5 77,20 77,17.5 77.5,17 R204.1 R205.1 77.5,2.45 76.75,1.7 56.2,1.7 55.03,2.87 LED201.4
  Top 0.61: C203.2 81.55,20.5 R207.1 86.8,20.5 89.2,18.1 89.2,14.5 92,11.7 J203.2 | R206.1 81.45,20.5 C203.2 | C201.2 54.41,24.4 v56.5,24.4 | v81.9,22.3 C203.2
  Top 1.016: J104.2 13.96,43.46 14.5,44 44,44 v44.5,43.5
  Bottom 0.61: J201.1.R 51.21,26.24 53.05,24.4 v56.5,24.4 61,28.9 76.7,28.9 79.9,25.7 79.9,23.5 81.1,22.3 v81.9,22.3 82.8,22.3 91,30.5 91,32.4 91.59,32.99 J202.2
  Bottom 1.016: v44.5,43.5 46,43.5 47.5,42 47.5,30.5 45.5,28.5 43,28.5 42.06,27.56 J201.1.R J201.1.L

### Text on the board
tPlace: 5V0 | 3V3 | JACK | USB | Q.SW | VDD | VSS | RA5 | RA0 | RA4 | RA1 | RA3 | RA2 | RC5 | RC0 | MCLR | RC4 | RC1 | RC2 | RC3 | RC2 | CP2102 Module | RC6 | RB4 | RC7 | RB5 | RB7 | RB6 | Hello World!